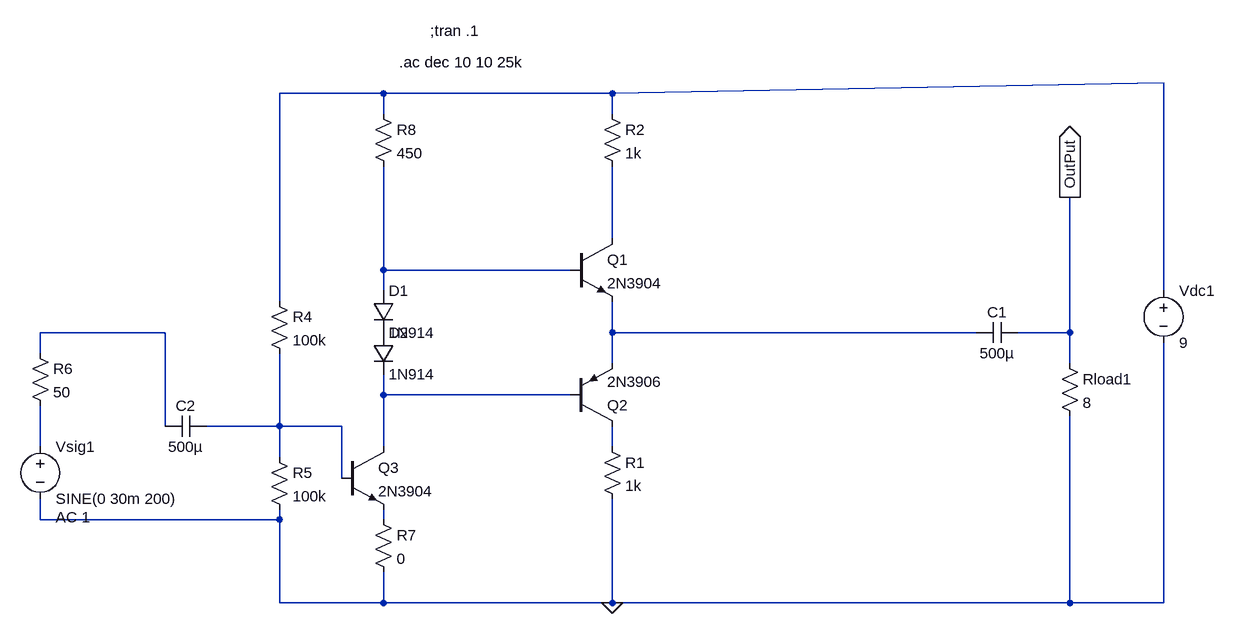
[diagram p0: schematic AB_Amp.asc]
AB_Amp.asc, the LTspice schematic file:
Version 4
SHEET 1 1060 680
WIRE -224 -240 -384 -240
WIRE 128 -240 976 -256
WIRE 128 -240 -224 -240
WIRE -224 -208 -224 -240
WIRE 128 -208 128 -240
WIRE 128 -16 128 -128
WIRE -224 32 -224 -128
WIRE 64 32 -224 32
WIRE -224 64 -224 32
WIRE 976 64 976 -256
WIRE -384 80 -384 -240
WIRE -560 128 -752 128
WIRE 128 128 128 80
WIRE 688 128 128 128
WIRE 832 128 832 -80
WIRE 832 128 752 128
WIRE -752 160 -752 128
WIRE 128 176 128 128
WIRE 832 176 832 128
WIRE -224 224 -224 192
WIRE 64 224 -224 224
WIRE -560 272 -560 128
WIRE -384 272 -384 160
WIRE -384 272 -496 272
WIRE -288 272 -384 272
WIRE -752 304 -752 240
WIRE -224 304 -224 224
WIRE 128 304 128 272
WIRE -384 320 -384 272
WIRE -288 352 -288 272
WIRE -752 416 -752 384
WIRE -384 416 -384 400
WIRE -384 416 -752 416
WIRE -224 416 -224 400
WIRE -384 544 -384 416
WIRE -224 544 -224 496
WIRE -224 544 -384 544
WIRE 128 544 128 384
WIRE 128 544 -224 544
WIRE 832 544 832 256
WIRE 832 544 128 544
WIRE 976 544 976 144
WIRE 976 544 832 544
FLAG 128 544 0
FLAG 832 -80 OutPut
IOPIN 832 -80 Out
SYMBOL npn 64 -16 R0
SYMATTR InstName Q1
SYMATTR Value 2N3904
SYMBOL pnp 64 272 M180
SYMATTR InstName Q2
SYMATTR Value 2N3906
SYMBOL res 816 160 R0
SYMATTR InstName Rload1
SYMATTR Value 8
SYMBOL cap 752 112 R90
WINDOW 0 0 32 VBottom 2
WINDOW 3 32 32 VTop 2
SYMATTR InstName C1
SYMATTR Value 500µ
SYMBOL voltage 976 48 R0
SYMATTR InstName Vdc1
SYMATTR Value 9
SYMBOL res 112 288 R0
SYMATTR InstName R1
SYMATTR Value 1k
SYMBOL res 112 -224 R0
SYMATTR InstName R2
SYMATTR Value 1k
SYMBOL diode -240 64 R0
SYMATTR InstName D1
SYMATTR Value 1N914
SYMBOL diode -240 128 R0
SYMATTR InstName D2
SYMATTR Value 1N914
SYMBOL npn -288 304 R0
SYMATTR InstName Q3
SYMATTR Value 2N3904
SYMBOL res -240 -224 R0
SYMATTR InstName R8
SYMATTR Value 450
SYMBOL res -400 64 R0
SYMATTR InstName R4
SYMATTR Value 100k
SYMBOL res -400 304 R0
SYMATTR InstName R5
SYMATTR Value 100k
SYMBOL res -768 144 R0
SYMATTR InstName R6
SYMATTR Value 50
SYMBOL cap -496 256 R90
WINDOW 0 0 32 VBottom 2
WINDOW 3 32 32 VTop 2
SYMATTR InstName C2
SYMATTR Value 500µ
SYMBOL res -240 400 R0
SYMATTR InstName R7
SYMATTR Value 0
SYMBOL voltage -752 288 R0
WINDOW 123 24 124 Left 2
WINDOW 39 0 0 Left 2
SYMATTR Value2 AC 1
SYMATTR InstName Vsig1
SYMATTR Value SINE(0 30m 200)
TEXT -152 -336 Left 2 !;tran .1
TEXT -200 -288 Left 2 !.ac dec 10 10 25k

The netlist it stands for:
* AB_Amp.asc
Q1 N002 N003 N005 0 2N3904
Q2 N009 N006 N005 0 2N3906
Rload1 OutPut 0 8
C1 OutPut N005 500µ
Vdc1 N001 0 9
R1 N009 0 1k
R2 N001 N002 1k
D1 N003 P001 1N914
D2 P001 N006 1N914
Q3 N006 N007 N010 0 2N3904
R8 N001 N003 450
R4 N001 N007 100k
R5 N007 0 100k
R6 N004 N008 50
C2 N007 N004 500µ
R7 N010 0 0
Vsig1 N008 0 SINE(0 30m 200) AC 1
.model D D
.lib standard.dio
.model NPN NPN
.model PNP PNP
.lib standard.bjt
;tran .1
.ac dec 10 10 25k
.backanno
.end